# EAGLE design Proximity_sensor_v1p0 (EAGLE 9.4.2)
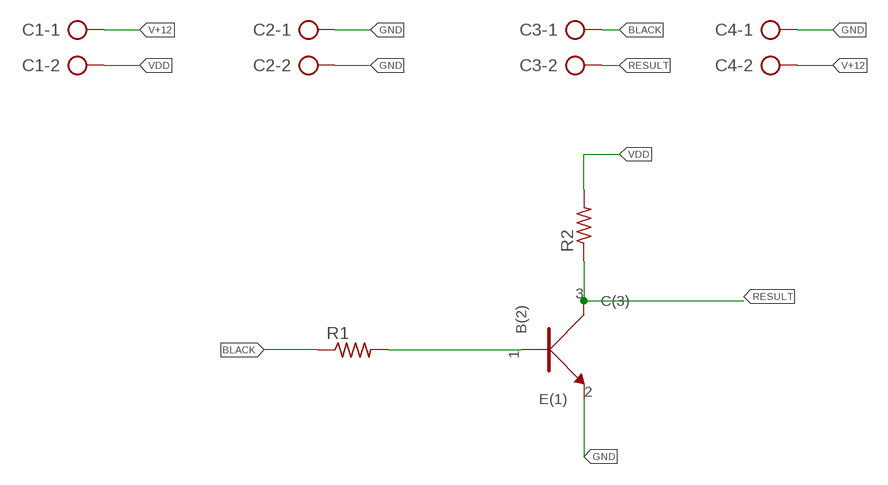
[diagram p0: schematic, sheet 1]

## Parts
C1  AK300/2  [AK300/2]
C2  AK300/2  [AK300/2]
C3  AK300/2  [AK300/2]
C4  AK300/2  [AK300/2]
R1  R_0805  [0805]
R2  R_0805  [0805]
U1  BC846BW  [SOT323]

## Nets
BLACK: C3.1 R1.1
GND: C2.1 C2.2 C4.1 U1.2(E(1))
N$1: R1.2 U1.1(B(2))
RESULT: C3.2 R2.1 U1.3(C(3))
V+12: C1.1 C4.2
VDD: C1.2 R2.2

## Library data of the parts
C1-C4 = 3D_MIG_Controller:AK300/2: CONNECTOR; OC_FARNELL: unknown; OC_NEWARK: unknown
R1 R2 = 3D_MIG_Controller:R_0805
U1 = 3D_MIG_Controller:BC846BW; MANUFACTURER_PART_NUMBER: BC846BW; VENDOR: Nexperia

## Board
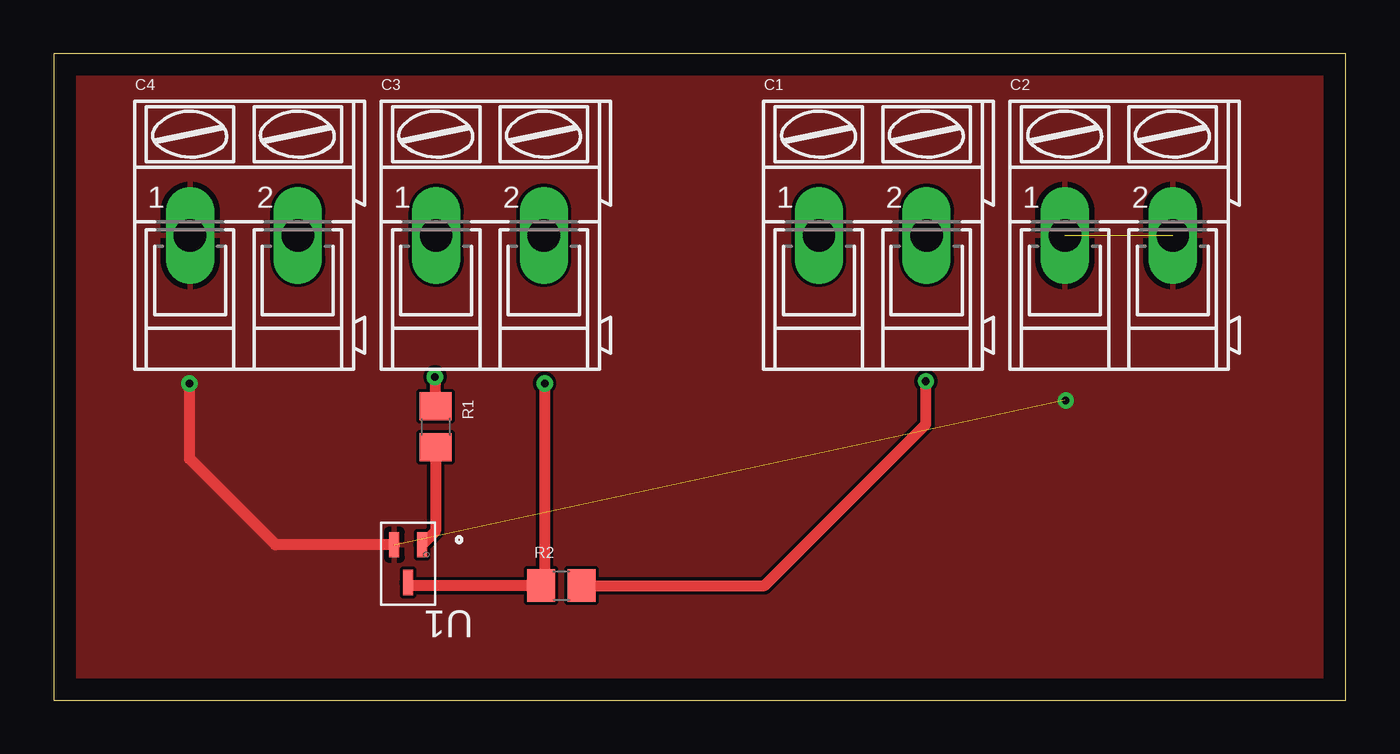
[diagram p1: board, top side]
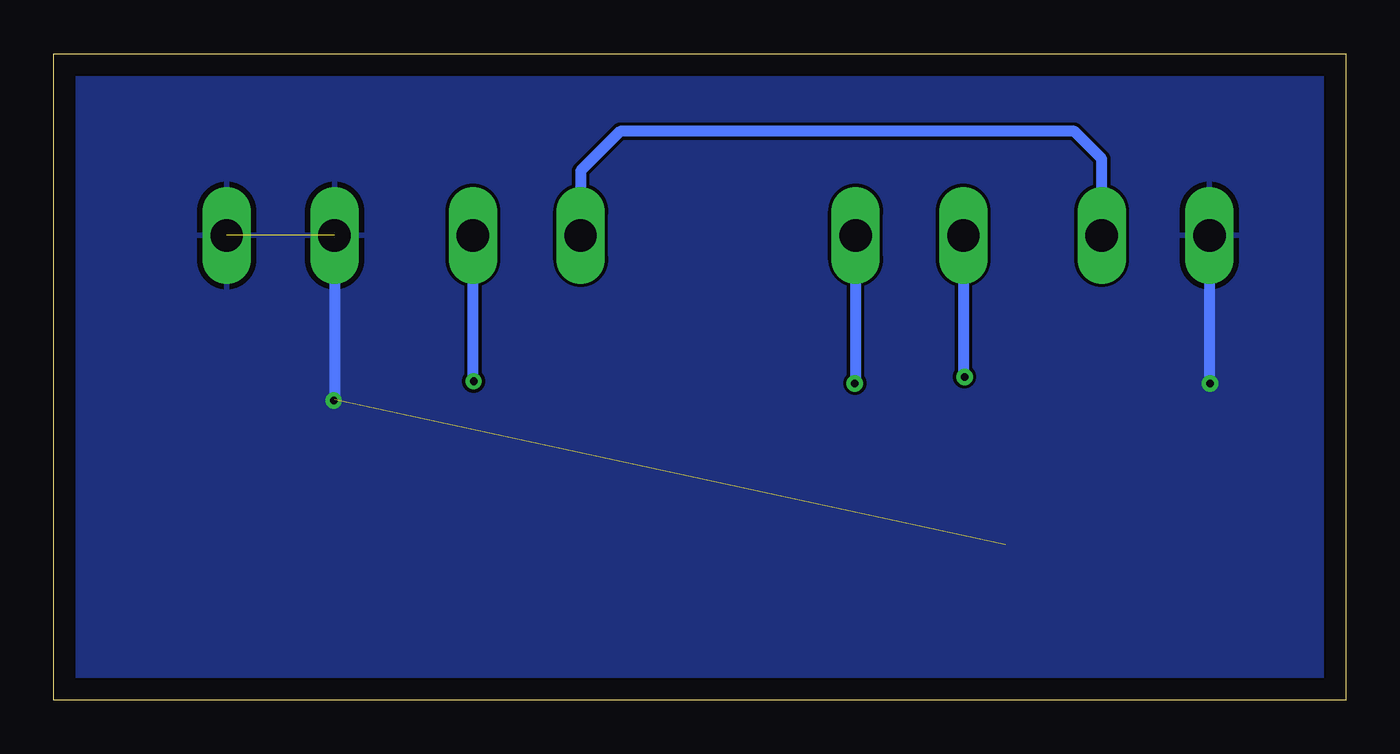
[diagram p2: board, bottom side, seen from below]

Size 60 x 30 mm. Coordinates in mm from the lower left corner, seen from the top.
Outline: 0,0 60,0 60,30 0,30 0,0
Copper layers (1*16): Top 0.035mm / dielectric 1.5mm / Bottom 0.035mm
Design rules "default": minimum track width 6mil, minimum drill 0.35mm, track to track 6mil, track to pad 6mil, pad to pad 6mil, via to via 6mil, smd to smd 6mil, copper to edge 40mil, drill to drill 6mil, minimum pad ring 10mil, minimum via ring 8mil, stop-mask expansion 4mil, vias tented up to drill 0mil, thermal gap 10mil

### Footprints (pad centres in the part's own frame; a part is rotated, then mirrored left to right if it is on the bottom)
AK300/2 = drill 1.5 long: 1 -2.515,0; 2 2.489,0
0805 = smd 1.3 x 1.5: 1 -0.95,0; 2 0.95,0
SOT323 = smd 0.457 x 1.168: 1 -0.65,-0.876; 2 0.65,-0.876; 3 0,0.876

### Placement (x,y rotation side)
C1  38.05,21.57 0 top
C2  49.48,21.57 0 top
C3  20.27,21.57 0 top
C4  8.84,21.57 0 top
R1  17.73,12.68 270 top
R2  23.57,5.31 0 top
U1  16.46,6.33 180 top

### Tracks (layer width: path | path; a pad name or v marks a point on that pad's centre or on a via)
BLACK  (via drill 0.35)
  Top 0.508: v17.7,15 17.7,13.66 R1.1
  Bottom 0.508: C3.1 17.75,15.05 v17.7,15
GND  (via drill 0.35)  (2 unrouted)
  Top 0.508: U1.2 10.29,7.21 6.3,11.2 v6.3,14.7
  Bottom 0.508: v6.3,14.7 6.3,21.55 C4.1 | C2.1 46.97,13.94 v47,13.9
  pour Top: 0,0 0,30 60,30 60,0
  pour Bottom: 0,0 60,0 60,30 0,30
N$1
  Top 0.508: R1.2 17.73,7.83 U1.1
RESULT  (via drill 0.35)
  Top 0.508: v22.8,14.7 22.8,5.49 R2.1 16.6,5.31 U1.3
  Bottom 0.508: C3.2 22.76,14.74 v22.8,14.7
V+12
  Bottom 0.508: C4.2 11.33,25.13 12.6,26.4 33.7,26.4 35.53,24.57 C1.1
VDD  (via drill 0.35)
  Top 0.508: R2.2 33.01,5.31 40.5,12.8 v40.5,14.8
  Bottom 0.508: v40.5,14.8 40.54,14.84 C1.2